# EAGLE schematic daryldaryl (EAGLE 7.7.0)
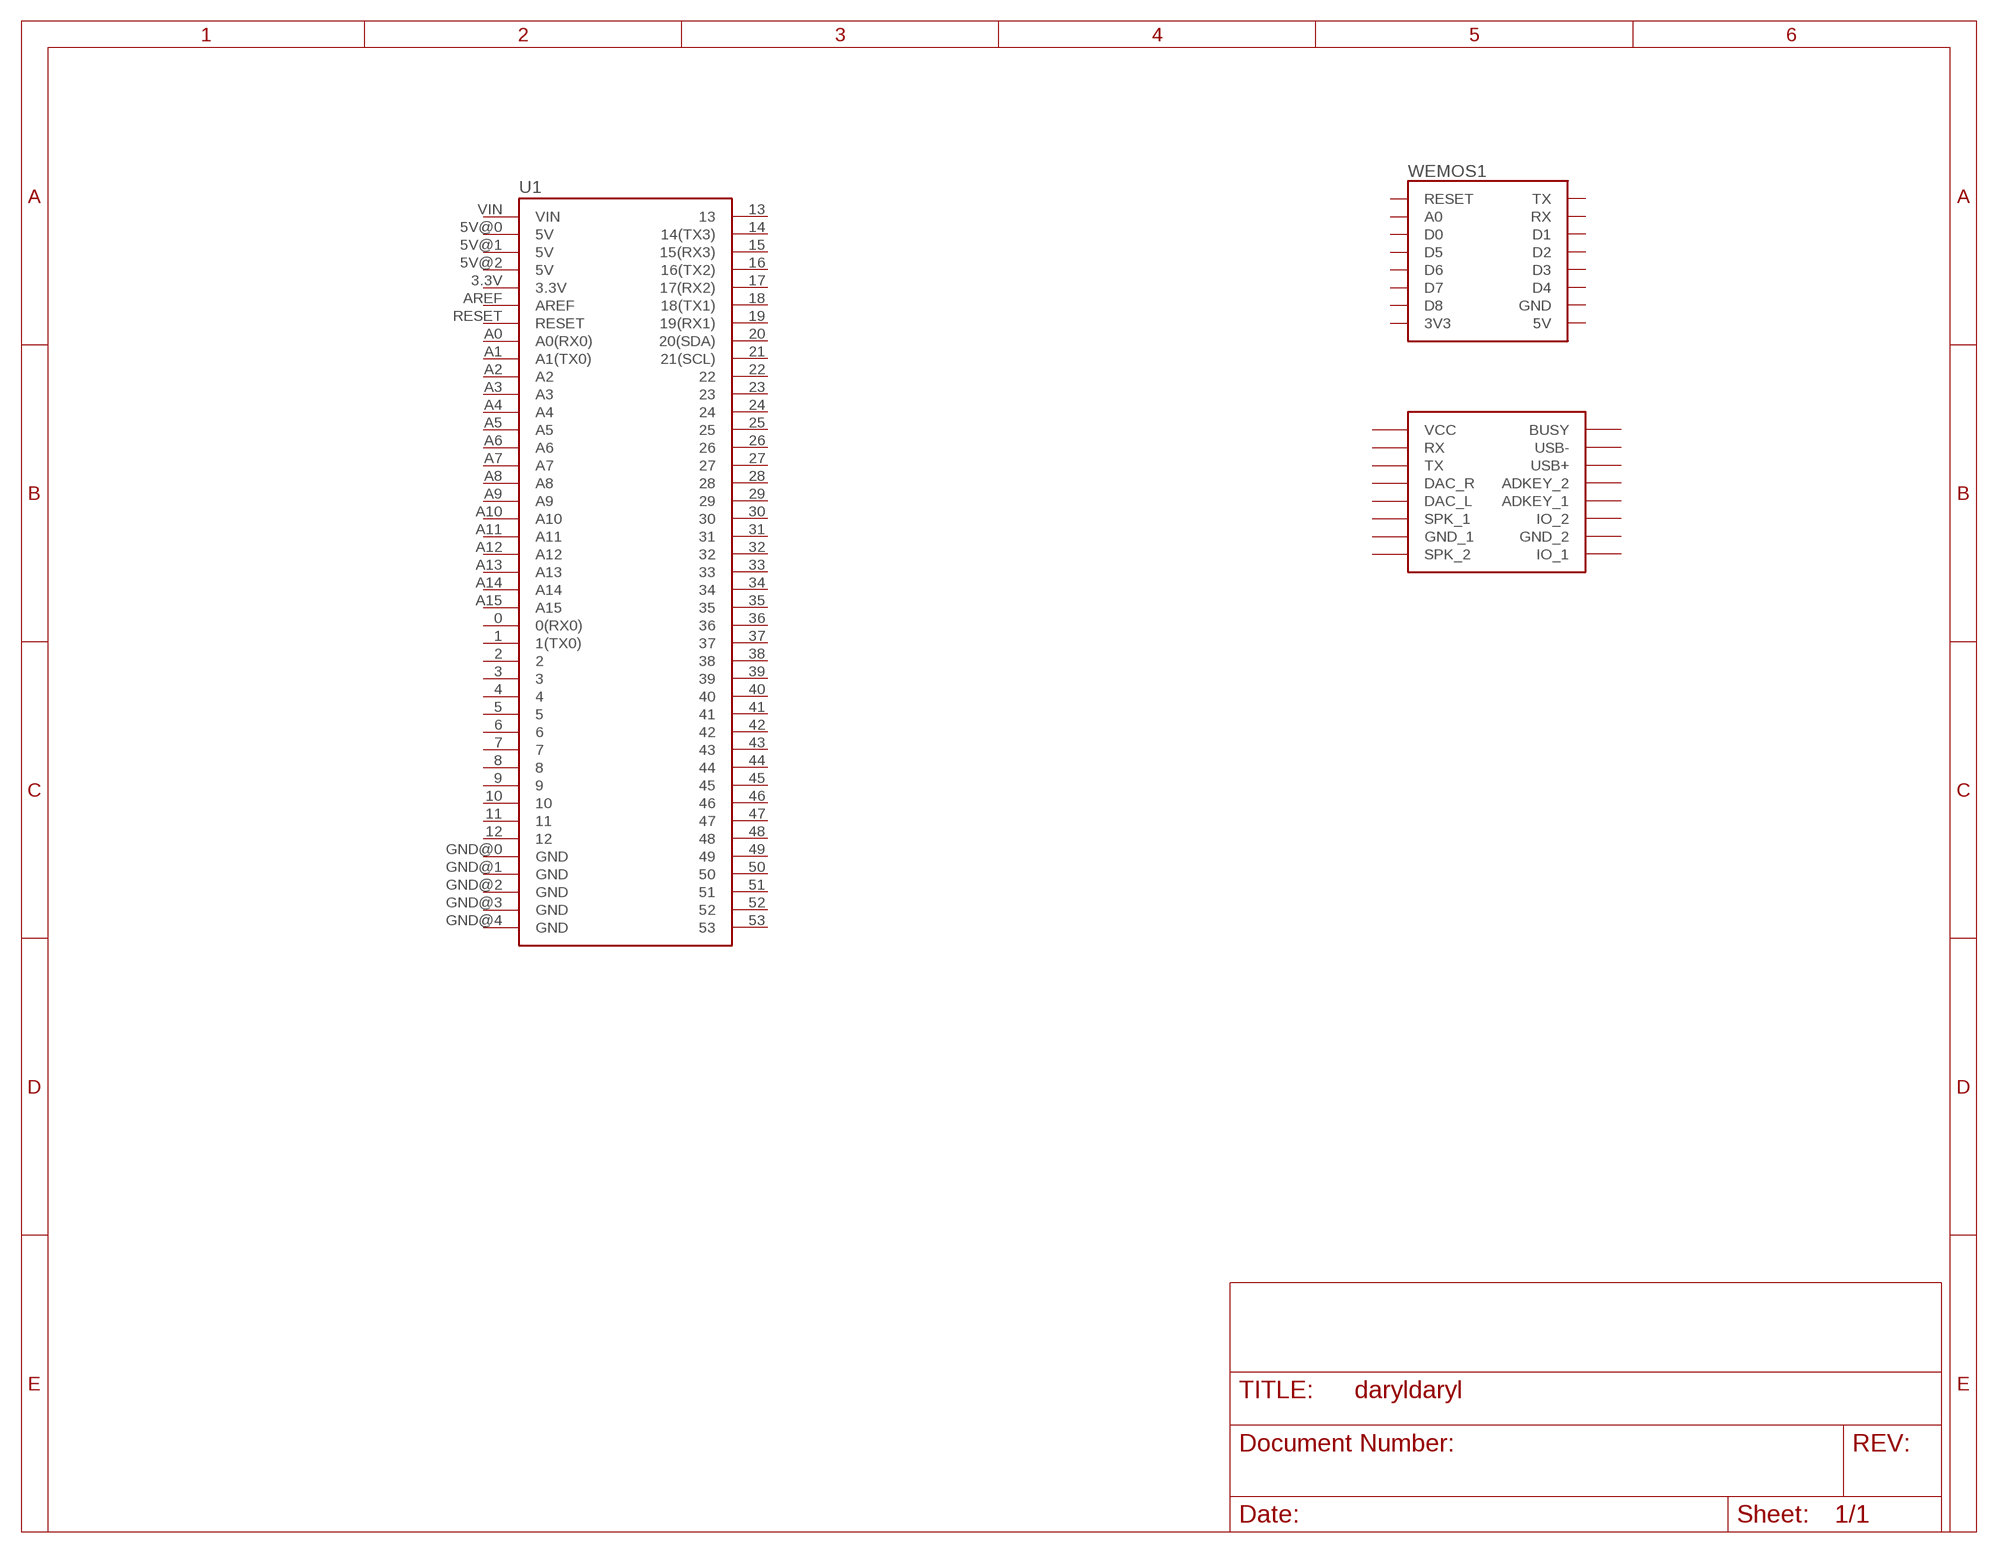
[diagram p0: schematic, sheet 1]

## Parts
U1  BOARD-ARDUINO-MEGAFULL  [ARDUINO_MEGA]
U2  BOARD-DFPLAYER  [DFPLAYER]
WEMOS1  RADIO-WEMOS-D1-MINI  [WEMOS-D1-MINI]
Unconnected: U1.0(0(RX0)) U1.1(1(TX0)) U1.2 U1.3 U1.3.3V U1.4 U1.5 U1.5V@0(5V) U1.5V@1(5V) U1.5V@2(5V) U1.6 U1.7 U1.8 U1.9 U1.10 U1.11 U1.12 U1.13 U1.14(14(TX3)) U1.15(15(RX3)) U1.16(16(TX2)) U1.17(17(RX2)) U1.18(18(TX1)) U1.19(19(RX1)) U1.20(20(SDA)) U1.21(21(SCL)) U1.22 U1.23 U1.24 U1.25 U1.26 U1.27 U1.28 U1.29 U1.30 U1.31 U1.32 U1.33 U1.34 U1.35 U1.36 U1.37 U1.38 U1.39 U1.40 U1.41 U1.42 U1.43 U1.44 U1.45 U1.46 U1.47 U1.48 U1.49 U1.50 U1.51 U1.52 U1.53 U1.A0(A0(RX0)) U1.A1(A1(TX0)) U1.A2 U1.A3 U1.A4 U1.A5 U1.A6 U1.A7 U1.A8 U1.A9 U1.A10 U1.A11 U1.A12 U1.A13 U1.A14 U1.A15 U1.AREF U1.GND@0(GND) U1.GND@1(GND) U1.GND@2(GND) U1.GND@3(GND) U1.GND@4(GND) U1.RESET U1.VIN U2.ADKEY1(ADKEY_1) U2.ADKEY2(ADKEY_2) U2.BUSY U2.DAC_L U2.DAC_R U2.GND_1 U2.GND_2 U2.IO1(IO_1) U2.IO2(IO_2) U2.RX U2.SPK1(SPK_1) U2.SPK2(SPK_2) U2.TX U2.USB+ U2.USB- U2.VCC WEMOS1.3V3 WEMOS1.5V WEMOS1.A0 WEMOS1.D0 WEMOS1.D1 WEMOS1.D2 WEMOS1.D3 WEMOS1.D4 WEMOS1.D5 WEMOS1.D6 WEMOS1.D7 WEMOS1.D8 WEMOS1.GND WEMOS1.RESET WEMOS1.RX WEMOS1.TX

## Library data of the parts
U1 = holla:BOARD-ARDUINO-MEGA: Arduino Mega board footprint
U2 = holla:BOARD-DFPLAYER
WEMOS1 = holla:RADIO-WEMOS-D1-MINI: WeMos.cc D1 mini ESP8266 module